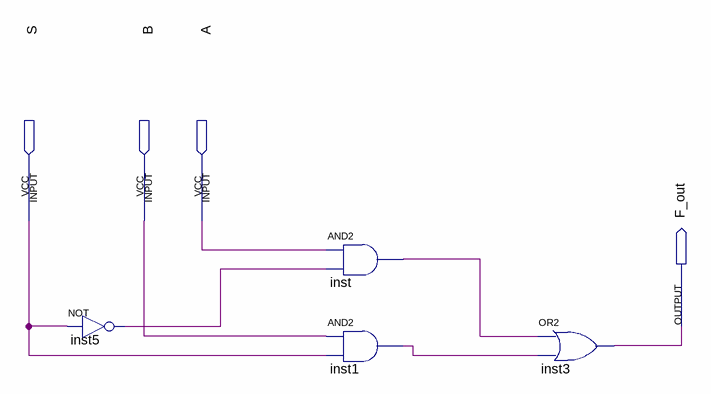
[diagram p0: schematic sheet]
// Quartus schematic MUX_GATE.bdf as structural Verilog: 4 symbols, 4 pins
module MUX_GATE (
  input  S,
  input  B,
  input  A,
  output F_out
);

  wire inst1_out, inst5_out, inst_out;

  not inst5 (inst5_out, S);
  and inst (inst_out, A, inst5_out);
  and inst1 (inst1_out, B, S);
  or inst3 (F_out, inst_out, inst1_out);
endmodule
